# Altium schematic sheet FPGA_Dev_Board.SchDoc
size A; SheetNumber: 2; SheetTotal: 8
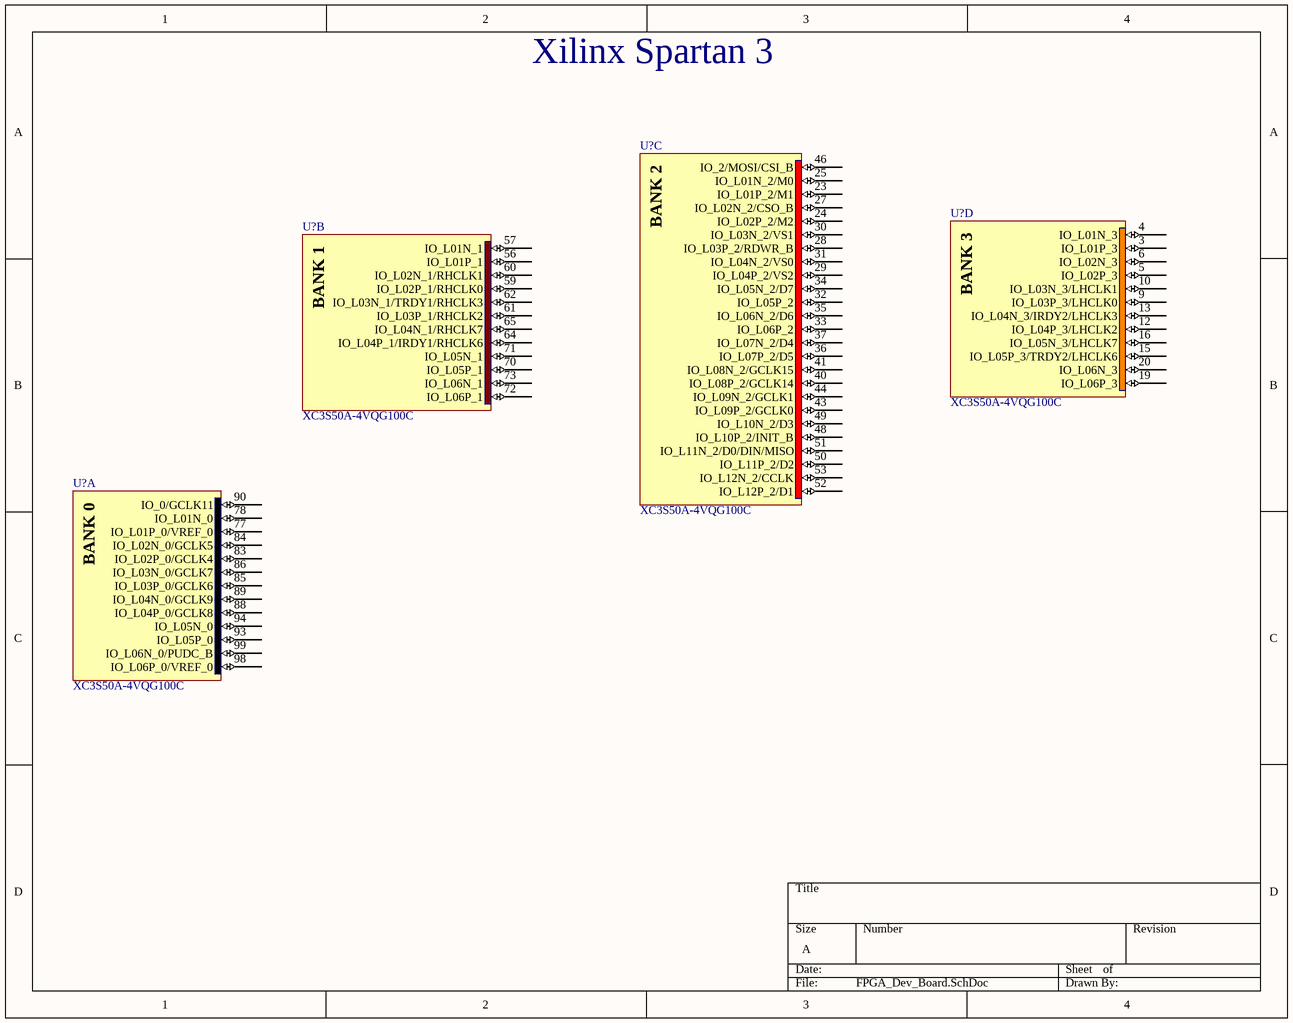
[diagram p0: FPGA_Dev_Board.SchDoc]

## Parts
(Parts that share a designator on the sheet are numbered #1, #2 ... from top to bottom, then left to right.)
U?#1  XC3S50A-4VQG100C  [VQG100_N]  (part C of 8)
U?#2  XC3S50A-4VQG100C  [VQG100_N]  (part D of 8)
U?#3  XC3S50A-4VQG100C  [VQG100_N]  (part B of 8)
U?#4  XC3S50A-4VQG100C  [VQG100_N]  (part A of 8)

## Nets

Not connected (* = marked no-connect by the designer): U?#1 23(IO_L01P_2/M1) 24(IO_L02P_2/M2) 25(IO_L01N_2/M0) 27(IO_L02N_2/CSO_B) 28(IO_L03P_2/RDWR_B) 29(IO_L04P_2/VS2) 30(IO_L03N_2/VS1) 31(IO_L04N_2/VS0) 32(IO_L05P_2) 33(IO_L06P_2) 34(IO_L05N_2/D7) 35(IO_L06N_2/D6) 36(IO_L07P_2/D5) 37(IO_L07N_2/D4) 40(IO_L08P_2/GCLK14) 41(IO_L08N_2/GCLK15) 43(IO_L09P_2/GCLK0) 44(IO_L09N_2/GCLK1) 46(IO_2/MOSI/CSI_B) 48(IO_L10P_2/INIT_B) 49(IO_L10N_2/D3) 50(IO_L11P_2/D2) 51(IO_L11N_2/D0/DIN/MISO) 52(IO_L12P_2/D1) 53(IO_L12N_2/CCLK); U?#2 3(IO_L01P_3) 4(IO_L01N_3) 5(IO_L02P_3) 6(IO_L02N_3) 9(IO_L03P_3/LHCLK0) 10(IO_L03N_3/LHCLK1) 12(IO_L04P_3/LHCLK2) 13(IO_L04N_3/IRDY2/LHCLK3) 15(IO_L05P_3/TRDY2/LHCLK6) 16(IO_L05N_3/LHCLK7) 19(IO_L06P_3) 20(IO_L06N_3); U?#3 56(IO_L01P_1) 57(IO_L01N_1) 59(IO_L02P_1/RHCLK0) 60(IO_L02N_1/RHCLK1) 61(IO_L03P_1/RHCLK2) 62(IO_L03N_1/TRDY1/RHCLK3) 64(IO_L04P_1/IRDY1/RHCLK6) 65(IO_L04N_1/RHCLK7) 70(IO_L05P_1) 71(IO_L05N_1) 72(IO_L06P_1) 73(IO_L06N_1); U?#4 77(IO_L01P_0/VREF_0) 78(IO_L01N_0) 83(IO_L02P_0/GCLK4) 84(IO_L02N_0/GCLK5) 85(IO_L03P_0/GCLK6) 86(IO_L03N_0/GCLK7) 88(IO_L04P_0/GCLK8) 89(IO_L04N_0/GCLK9) 90(IO_0/GCLK11) 93(IO_L05P_0) 94(IO_L05N_0) 98(IO_L06P_0/VREF_0) 99(IO_L06N_0/PUDC_B)

## Notes on the sheet
- Xilinx Spartan 3
- (in symbol CMP-0049-00079-1, part A) BANK 0
- (in symbol CMP-0049-00079-1, part B) BANK 1
- (in symbol CMP-0049-00079-1, part C) BANK 2
- (in symbol CMP-0049-00079-1, part D) BANK 3

## Library data of the parts
U?#1-U?#4 = CMP-0049-00079-1: Spartan-3A I/O Optimized FPGA, 68 User I/Os, 100-Pin VQFP, Standard Performance, Commercial Grade, Pb-Free; PackageReference: VQG100; DatasheetVersion: ver1.8, Mar-2009; PackageDescription: 100-Pin Very Thin Quad Flat Pack (VQG100) - Pb-Free; PackageVersion: ver1.2.1, Feb-2007; Code_JEDEC: MS-026-AED